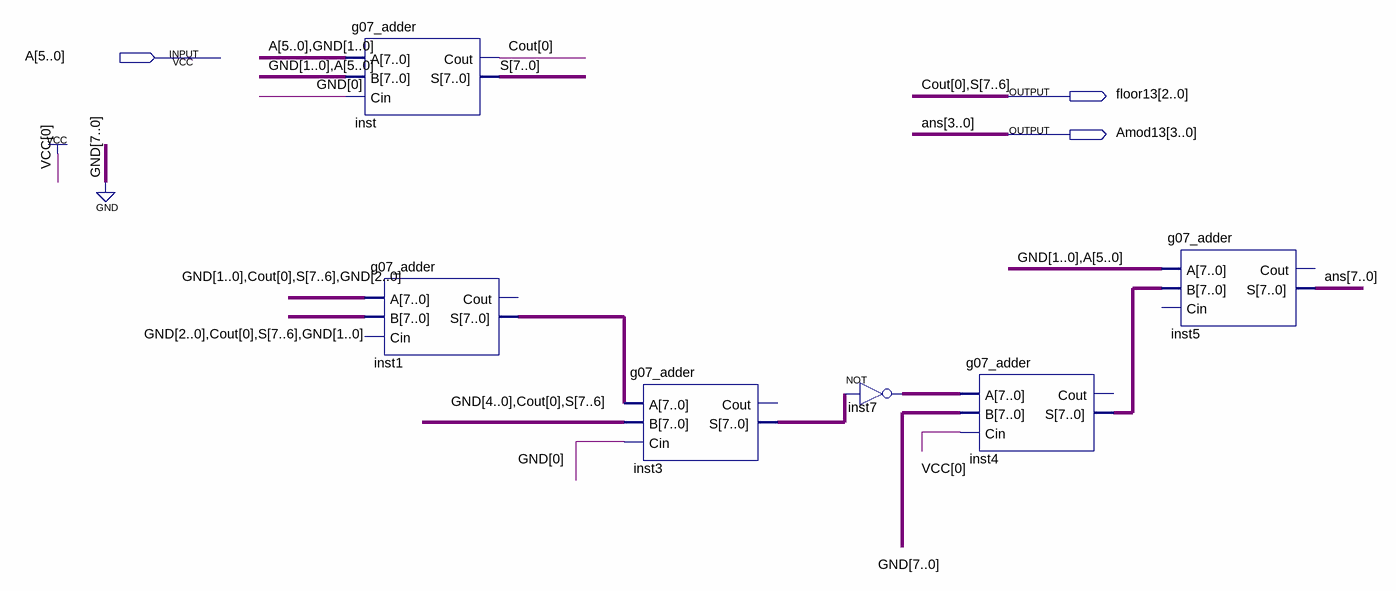
[diagram p0: schematic sheet]
// Quartus schematic g07_Modulo_13.bdf as structural Verilog: 6 symbols, 3 pins
module g07_Modulo_13 (
  input  [5:0] A,
  output [2:0] floor13,
  output [3:0] Amod13
);

  wire [5:0] S;
  wire [7:0] inst1_s, inst3_s, inst4_s, inst7_out;
  wire [7:4] ans;

  g07_adder inst (.A({A, 2'b00}), .B({2'b00, A}), .Cin(1'b0), .Cout(floor13[2]), .S({floor13[1:0], S}));
  g07_adder inst1 (.A({2'b00, floor13, 3'b000}), .B({3'b000, floor13, 2'b00}), .S(inst1_s));  // open: Cin, Cout
  g07_adder inst3 (.A(inst1_s), .B({{5{1'b0}}, floor13}), .Cin(1'b0), .S(inst3_s));  // open: Cout
  assign inst7_out = ~inst3_s;  // NOT inst7, 8 bits wide
  g07_adder inst4 (.A(inst7_out), .B({8{1'b0}}), .Cin(1'b1), .S(inst4_s));  // open: Cout
  g07_adder inst5 (.A({2'b00, A}), .B(inst4_s), .S({ans, Amod13}));  // open: Cin, Cout

  // Other names for the same wires on the sheet: ans[3:0] = Amod13; Cout[0] = floor13[2]; S[7:6] = floor13[1:0]
endmodule
